# EAGLE schematic RASP_GPIO_DAC_ADC_2 (EAGLE 7.5.0)

## Sheet 1 of 2
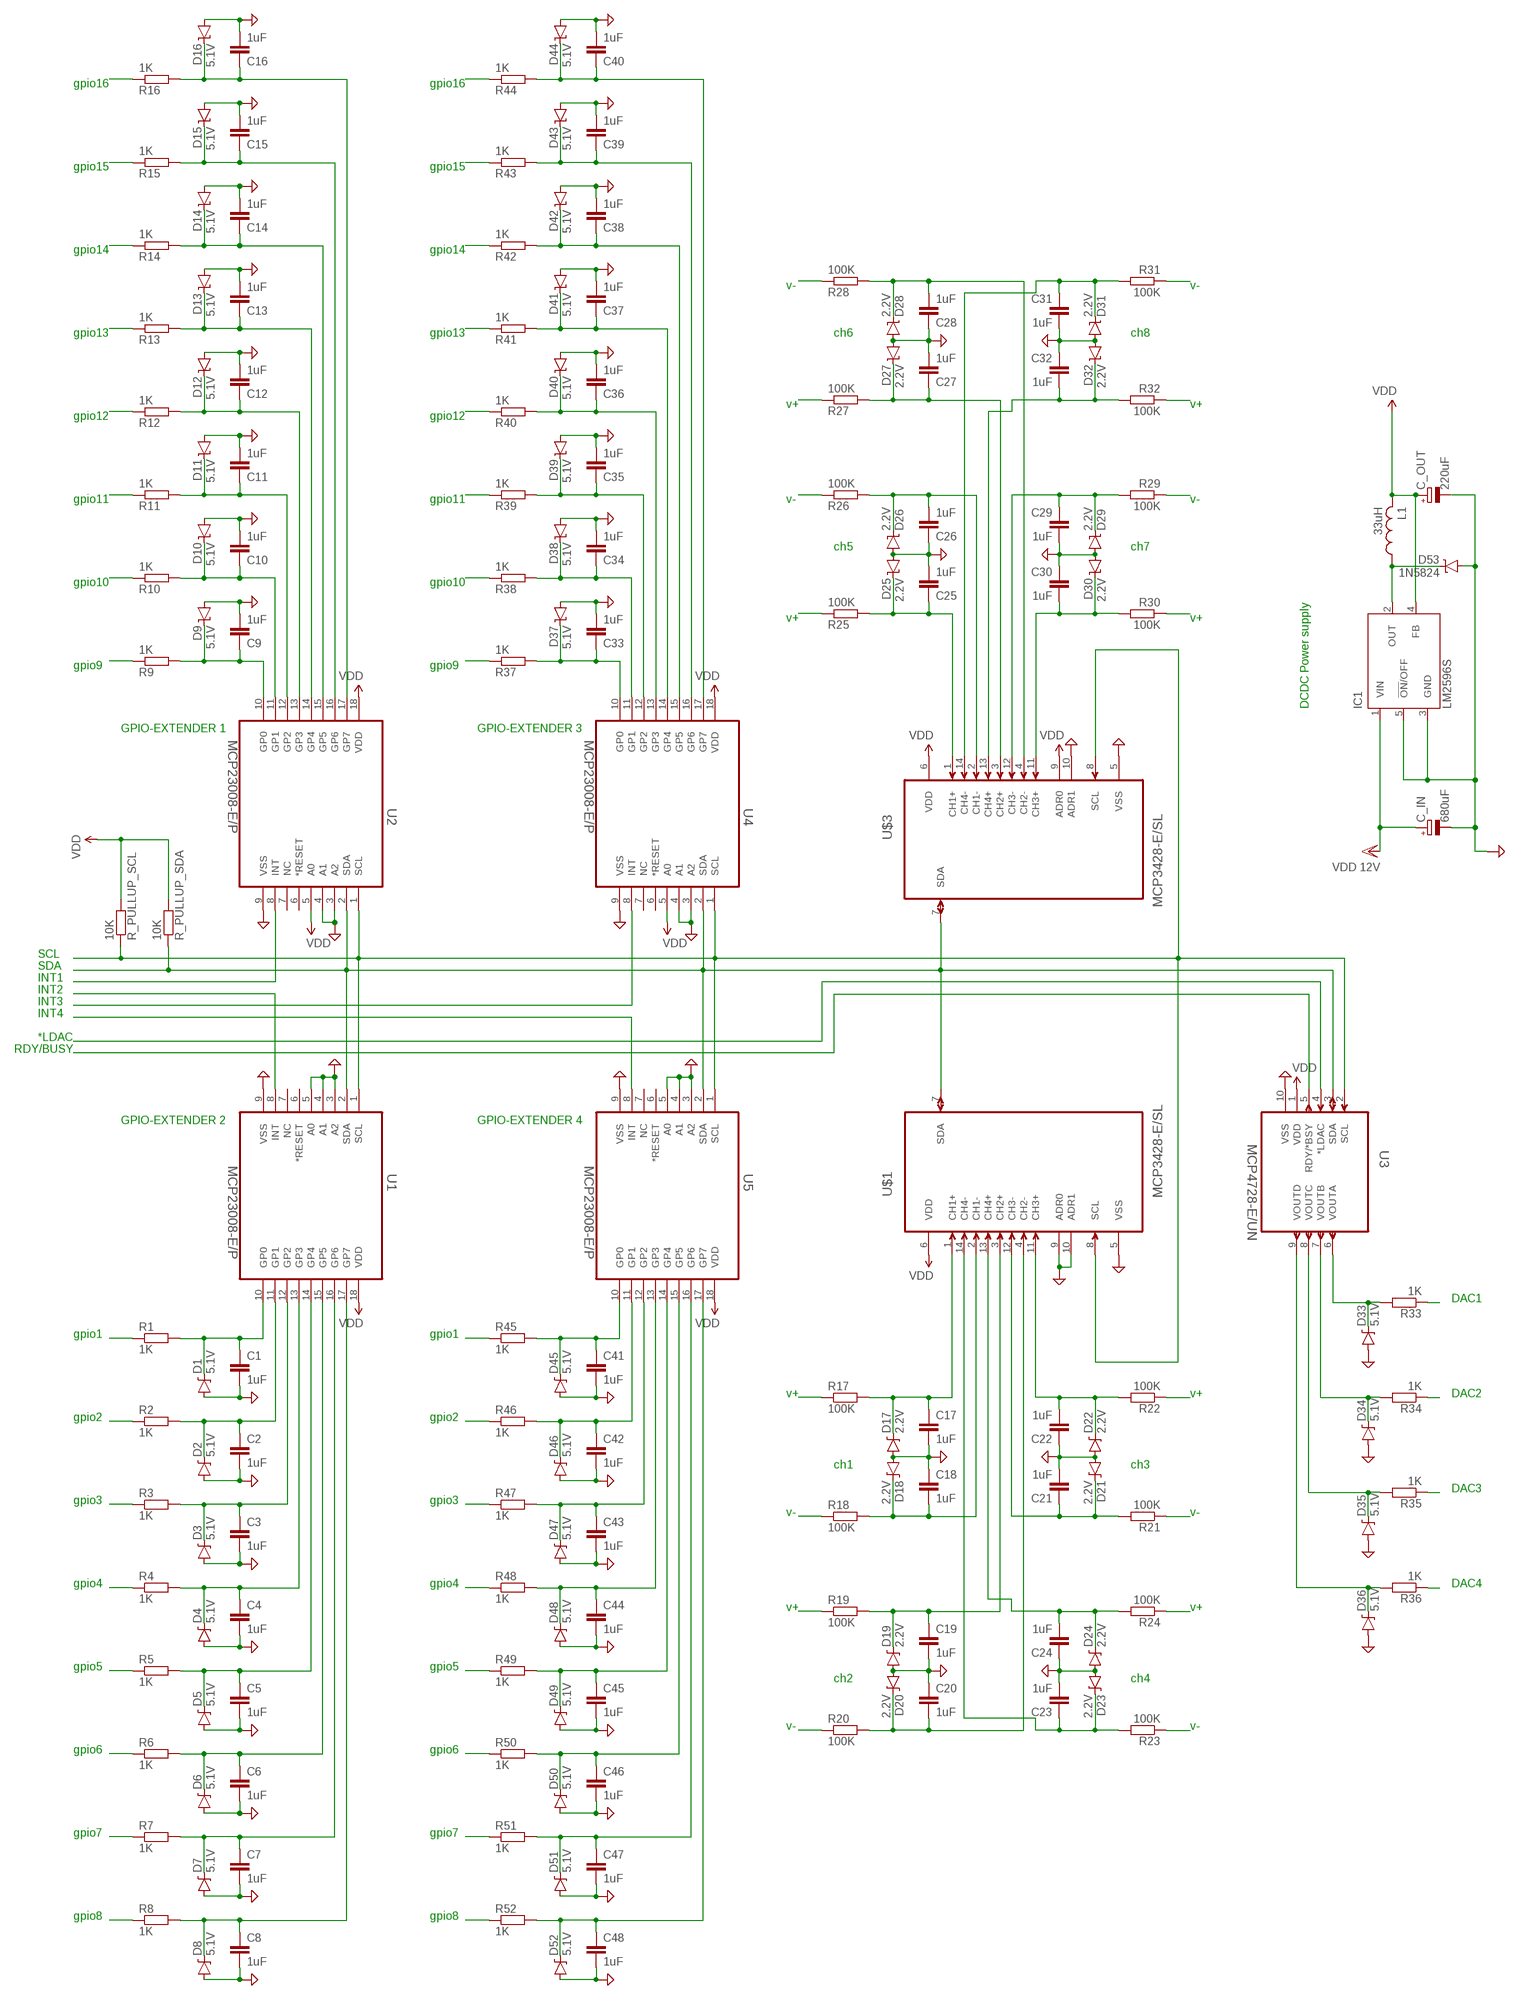
[diagram p0: schematic, sheet 1]

### Parts
C1  1uF  C2,5-3  [C2.5-3]
C2  1uF  C2,5-3  [C2.5-3]
C3  1uF  C2,5-3  [C2.5-3]
C4  1uF  C2,5-3  [C2.5-3]
C5  1uF  C2,5-3  [C2.5-3]
C6  1uF  C2,5-3  [C2.5-3]
C7  1uF  C2,5-3  [C2.5-3]
C8  1uF  C2,5-3  [C2.5-3]
C9  1uF  C2,5-3  [C2.5-3]
C10  1uF  C2,5-3  [C2.5-3]
C11  1uF  C2,5-3  [C2.5-3]
C12  1uF  C2,5-3  [C2.5-3]
C13  1uF  C2,5-3  [C2.5-3]
C14  1uF  C2,5-3  [C2.5-3]
C15  1uF  C2,5-3  [C2.5-3]
C16  1uF  C2,5-3  [C2.5-3]
C17  1uF  C2,5-3  [C2.5-3]
C18  1uF  C2,5-3  [C2.5-3]
C19  1uF  C2,5-3  [C2.5-3]
C20  1uF  C2,5-3  [C2.5-3]
C21  1uF  C2,5-3  [C2.5-3]
C22  1uF  C2,5-3  [C2.5-3]
C23  1uF  C2,5-3  [C2.5-3]
C24  1uF  C2,5-3  [C2.5-3]
C25  1uF  C2,5-3  [C2.5-3]
C26  1uF  C2,5-3  [C2.5-3]
C27  1uF  C2,5-3  [C2.5-3]
C28  1uF  C2,5-3  [C2.5-3]
C29  1uF  C2,5-3  [C2.5-3]
C30  1uF  C2,5-3  [C2.5-3]
C31  1uF  C2,5-3  [C2.5-3]
C32  1uF  C2,5-3  [C2.5-3]
C33  1uF  C2,5-3  [C2.5-3]
C34  1uF  C2,5-3  [C2.5-3]
C35  1uF  C2,5-3  [C2.5-3]
C36  1uF  C2,5-3  [C2.5-3]
C37  1uF  C2,5-3  [C2.5-3]
C38  1uF  C2,5-3  [C2.5-3]
C39  1uF  C2,5-3  [C2.5-3]
C40  1uF  C2,5-3  [C2.5-3]
C41  1uF  C2,5-3  [C2.5-3]
C42  1uF  C2,5-3  [C2.5-3]
C43  1uF  C2,5-3  [C2.5-3]
C44  1uF  C2,5-3  [C2.5-3]
C45  1uF  C2,5-3  [C2.5-3]
C46  1uF  C2,5-3  [C2.5-3]
C47  1uF  C2,5-3  [C2.5-3]
C48  1uF  C2,5-3  [C2.5-3]
C_IN  680uF  CPOL-EU085CS-1AR  [085CS_1AR]
C_OUT  220uF  CPOL-EU085CS-1AR  [085CS_1AR]
D1  5.1V  DIODE-ZENER5.6V  [SOD-323]
D2  5.1V  DIODE-ZENER5.6V  [SOD-323]
D3  5.1V  DIODE-ZENER5.6V  [SOD-323]
D4  5.1V  DIODE-ZENER5.6V  [SOD-323]
D5  5.1V  DIODE-ZENER5.6V  [SOD-323]
D6  5.1V  DIODE-ZENER5.6V  [SOD-323]
D7  5.1V  DIODE-ZENER5.6V  [SOD-323]
D8  5.1V  DIODE-ZENER5.6V  [SOD-323]
D9  5.1V  DIODE-ZENER5.6V  [SOD-323]
D10  5.1V  DIODE-ZENER5.6V  [SOD-323]
D11  5.1V  DIODE-ZENER5.6V  [SOD-323]
D12  5.1V  DIODE-ZENER5.6V  [SOD-323]
D13  5.1V  DIODE-ZENER5.6V  [SOD-323]
D14  5.1V  DIODE-ZENER5.6V  [SOD-323]
D15  5.1V  DIODE-ZENER5.6V  [SOD-323]
D16  5.1V  DIODE-ZENER5.6V  [SOD-323]
D17  2.2V  DIODE-ZENER5.6V  [SOD-323]
D18  2.2V  DIODE-ZENER5.6V  [SOD-323]
D19  2.2V  DIODE-ZENER5.6V  [SOD-323]
D20  2.2V  DIODE-ZENER5.6V  [SOD-323]
D21  2.2V  DIODE-ZENER5.6V  [SOD-323]
D22  2.2V  DIODE-ZENER5.6V  [SOD-323]
D23  2.2V  DIODE-ZENER5.6V  [SOD-323]
D24  2.2V  DIODE-ZENER5.6V  [SOD-323]
D25  2.2V  DIODE-ZENER5.6V  [SOD-323]
D26  2.2V  DIODE-ZENER5.6V  [SOD-323]
D27  2.2V  DIODE-ZENER5.6V  [SOD-323]
D28  2.2V  DIODE-ZENER5.6V  [SOD-323]
D29  2.2V  DIODE-ZENER5.6V  [SOD-323]
D30  2.2V  DIODE-ZENER5.6V  [SOD-323]
D31  2.2V  DIODE-ZENER5.6V  [SOD-323]
D32  2.2V  DIODE-ZENER5.6V  [SOD-323]
D33  5.1V  DIODE-ZENER5.6V  [SOD-323]
D34  5.1V  DIODE-ZENER5.6V  [SOD-323]
D35  5.1V  DIODE-ZENER5.6V  [SOD-323]
D36  5.1V  DIODE-ZENER5.6V  [SOD-323]
D37  5.1V  DIODE-ZENER5.6V  [SOD-323]
D38  5.1V  DIODE-ZENER5.6V  [SOD-323]
D39  5.1V  DIODE-ZENER5.6V  [SOD-323]
D40  5.1V  DIODE-ZENER5.6V  [SOD-323]
D41  5.1V  DIODE-ZENER5.6V  [SOD-323]
D42  5.1V  DIODE-ZENER5.6V  [SOD-323]
D43  5.1V  DIODE-ZENER5.6V  [SOD-323]
D44  5.1V  DIODE-ZENER5.6V  [SOD-323]
D45  5.1V  DIODE-ZENER5.6V  [SOD-323]
D46  5.1V  DIODE-ZENER5.6V  [SOD-323]
D47  5.1V  DIODE-ZENER5.6V  [SOD-323]
D48  5.1V  DIODE-ZENER5.6V  [SOD-323]
D49  5.1V  DIODE-ZENER5.6V  [SOD-323]
D50  5.1V  DIODE-ZENER5.6V  [SOD-323]
D51  5.1V  DIODE-ZENER5.6V  [SOD-323]
D52  5.1V  DIODE-ZENER5.6V  [SOD-323]
D53  1N5824  DIODE-ZENER5.6V  [SOD-323]
IC1  LM2596S  [TO263-5]
L1  33uH  L-US0204/5  [0204/5]
R1  1K  R-EU_0204/2V  [0204V]
R2  1K  R-EU_0204/2V  [0204V]
R3  1K  R-EU_0204/2V  [0204V]
R4  1K  R-EU_0204/2V  [0204V]
R5  1K  R-EU_0204/2V  [0204V]
R6  1K  R-EU_0204/2V  [0204V]
R7  1K  R-EU_0204/2V  [0204V]
R8  1K  R-EU_0204/2V  [0204V]
R9  1K  R-EU_0204/2V  [0204V]
R10  1K  R-EU_0204/2V  [0204V]
R11  1K  R-EU_0204/2V  [0204V]
R12  1K  R-EU_0204/2V  [0204V]
R13  1K  R-EU_0204/2V  [0204V]
R14  1K  R-EU_0204/2V  [0204V]
R15  1K  R-EU_0204/2V  [0204V]
R16  1K  R-EU_0204/2V  [0204V]
R17  100K  R-EU_0204/2V  [0204V]
R18  100K  R-EU_0204/2V  [0204V]
R19  100K  R-EU_0204/2V  [0204V]
R20  100K  R-EU_0204/2V  [0204V]
R21  100K  R-EU_0204/2V  [0204V]
R22  100K  R-EU_0204/2V  [0204V]
R23  100K  R-EU_0204/2V  [0204V]
R24  100K  R-EU_0204/2V  [0204V]
R25  100K  R-EU_0204/2V  [0204V]
R26  100K  R-EU_0204/2V  [0204V]
R27  100K  R-EU_0204/2V  [0204V]
R28  100K  R-EU_0204/2V  [0204V]
R29  100K  R-EU_0204/2V  [0204V]
R30  100K  R-EU_0204/2V  [0204V]
R31  100K  R-EU_0204/2V  [0204V]
R32  100K  R-EU_0204/2V  [0204V]
R33  1K  R-EU_0204/2V  [0204V]
R34  1K  R-EU_0204/2V  [0204V]
R35  1K  R-EU_0204/2V  [0204V]
R36  1K  R-EU_0204/2V  [0204V]
R37  1K  R-EU_0204/2V  [0204V]
R38  1K  R-EU_0204/2V  [0204V]
R39  1K  R-EU_0204/2V  [0204V]
R40  1K  R-EU_0204/2V  [0204V]
R41  1K  R-EU_0204/2V  [0204V]
R42  1K  R-EU_0204/2V  [0204V]
R43  1K  R-EU_0204/2V  [0204V]
R44  1K  R-EU_0204/2V  [0204V]
R45  1K  R-EU_0204/2V  [0204V]
R46  1K  R-EU_0204/2V  [0204V]
R47  1K  R-EU_0204/2V  [0204V]
R48  1K  R-EU_0204/2V  [0204V]
R49  1K  R-EU_0204/2V  [0204V]
R50  1K  R-EU_0204/2V  [0204V]
R51  1K  R-EU_0204/2V  [0204V]
R52  1K  R-EU_0204/2V  [0204V]
R_PULLUP_SCL  10K  R-EU_0204/2V  [0204V]
R_PULLUP_SDA  10K  R-EU_0204/2V  [0204V]
U1  MCP23008-E/P  [DIP254P762X533-18]
U2  MCP23008-E/P  [DIP254P762X533-18]
U3  MCP4728-E/UN  [SOP50P490X110-10N]
U4  MCP23008-E/P  [DIP254P762X533-18]
U5  MCP23008-E/P  [DIP254P762X533-18]
U$1  MCP3428-E/SL  [SOIC127P600X175-14N]
U$3  MCP3428-E/SL  [SOIC127P600X175-14N]

### Nets
GND: C1.2 C2.2 C3.2 C4.2 C5.2 C6.2 C7.2 C8.2 C9.2 C10.2 C11.2 C12.2 C13.2 C14.2 C15.2 C16.2 C17.2 C18.1 C19.2 C20.1 C21.2 C22.1 C23.2 C24.1 C25.2 C26.1 C27.2 C28.1 C29.2 C30.1 C31.2 C32.1 C33.2 C34.2 C35.2 C36.2 C37.2 C38.2 C39.2 C40.2 C41.2 C42.2 C43.2 C44.2 C45.2 C46.2 C47.2 C48.2 C_IN.- C_OUT.- D1.A D2.A D3.A D4.A D5.A D6.A D7.A D8.A D9.A D10.A D11.A D12.A D13.A D14.A D15.A D16.A D17.A D18.A D19.A D20.A D21.A D22.A D23.A D24.A D25.A D26.A D27.A D28.A D29.A D30.A D31.A D32.A D33.A D34.A D35.A D36.A D37.A D38.A D39.A D40.A D41.A D42.A D43.A D44.A D45.A D46.A D47.A D48.A D49.A D50.A D51.A D52.A D53.A IC1.3(GND) IC1.5(!ON!/OFF) U1.3(A2) U1.4(A1) U1.5(A0) U1.9(VSS) U2.3(A2) U2.4(A1) U2.9(VSS) U3.10(VSS) U4.3(A2) U4.4(A1) U4.9(VSS) U5.3(A2) U5.4(A1) U5.5(A0) U5.9(VSS) U$1.5(VSS) U$1.9(ADR0) U$1.10(ADR1) U$3.5(VSS) U$3.10(ADR1) ; also sheet 2
N$2: U1.8(INT)
N$3: R_PULLUP_SDA.1 U1.2(SDA) U2.2(SDA) U3.3(SDA) U4.2(SDA) U5.2(SDA) U$1.7(SDA) U$3.7(SDA)
N$4: U2.8(INT)
N$5: C1.1 D1.C R1.2 U1.10(GP0)
N$6: C2.1 D2.C R2.2 U1.11(GP1)
N$7: R1.1
N$8: R2.1
N$9: C3.1 D3.C R3.2 U1.12(GP2)
N$10: R3.1
N$11: C4.1 D4.C R4.2 U1.13(GP3)
N$12: R4.1
N$13: C5.1 D5.C R5.2 U1.14(GP4)
N$14: R5.1
N$15: C6.1 D6.C R6.2 U1.15(GP5)
N$16: R6.1
N$17: C7.1 D7.C R7.2 U1.16(GP6)
N$18: R7.1
N$19: C8.1 D8.C R8.2 U1.17(GP7)
N$20: R8.1
N$21: C9.1 D9.C R9.2 U2.10(GP0)
N$22: R9.1
N$23: C10.1 D10.C R10.2 U2.11(GP1)
N$24: R10.1
N$25: C11.1 D11.C R11.2 U2.12(GP2)
N$26: R11.1
N$27: C12.1 D12.C R12.2 U2.13(GP3)
N$28: R12.1
N$29: C13.1 D13.C R13.2 U2.14(GP4)
N$30: R13.1
N$31: C14.1 D14.C R14.2 U2.15(GP5)
N$32: R14.1
N$33: C15.1 D15.C R15.2 U2.16(GP6)
N$34: R15.1
N$35: C16.1 D16.C R16.2 U2.17(GP7)
N$36: R16.1
N$37: C17.1 D17.C R17.2 U$1.1(CH1+)
N$38: R17.1
N$39: C18.2 D18.C R18.2 U$1.2(CH1-)
N$40: C21.1 D21.C R21.2 U$1.12(CH3-)
N$41: R18.1
N$42: C19.1 D19.C R19.2 U$1.3(CH2+)
N$43: R19.1
N$44: C20.2 D20.C R20.2 U$1.4(CH2-)
N$45: R20.1
N$46: R21.1
N$47: C22.2 D22.C R22.2 U$1.11(CH3+)
N$48: R22.1
N$49: C23.1 D23.C R23.2 U$1.14(CH4-)
N$50: R23.1
N$51: C24.2 D24.C R24.2 U$1.13(CH4+)
N$52: R24.1
N$53: C25.1 D25.C R25.2 U$3.1(CH1+)
N$54: R25.1
N$55: C26.2 D26.C R26.2 U$3.2(CH1-)
N$56: R26.1
N$57: C27.1 D27.C R27.2 U$3.3(CH2+)
N$58: R27.1
N$59: C28.2 D28.C R28.2 U$3.4(CH2-)
N$60: R28.1
N$61: C29.1 D29.C R29.2 U$3.12(CH3-)
N$62: R29.1
N$63: C30.2 D30.C R30.2 U$3.11(CH3+)
N$64: R30.1
N$65: C31.1 D31.C R31.2 U$3.14(CH4-)
N$66: R31.1
N$67: C32.2 D32.C R32.2 U$3.13(CH4+)
N$68: R32.1
N$69: D33.C R33.2 U3.6(VOUTA)
N$70: R33.1
N$71: D34.C R34.2 U3.7(VOUTB)
N$72: R34.1
N$73: D35.C R35.2 U3.8(VOUTC)
N$74: R35.1
N$75: D36.C R36.2 U3.9(VOUTD)
N$76: R36.1
N$77: U3.4(*LDAC)
N$78: U4.8(INT)
N$79: U3.5(RDY/*BSY)
N$80: C33.1 D37.C R37.2 U4.10(GP0)
N$81: R37.1
N$82: C34.1 D38.C R38.2 U4.11(GP1)
N$83: R38.1
N$84: C35.1 D39.C R39.2 U4.12(GP2)
N$85: R39.1
N$86: C36.1 D40.C R40.2 U4.13(GP3)
N$87: R40.1
N$88: C37.1 D41.C R41.2 U4.14(GP4)
N$89: R41.1
N$90: C38.1 D42.C R42.2 U4.15(GP5)
N$91: R42.1
N$92: C39.1 D43.C R43.2 U4.16(GP6)
N$93: R43.1
N$94: C40.1 D44.C R44.2 U4.17(GP7)
N$95: R44.1
N$96: D53.C IC1.2(OUT) L1.1
N$97: U5.8(INT)
N$98: R_PULLUP_SCL.1 U1.1(SCL) U2.1(SCL) U3.2(SCL) U4.1(SCL) U5.1(SCL) U$1.8(SCL) U$3.8(SCL)
N$99: C41.1 D45.C R45.2 U5.10(GP0)
N$100: R45.1
N$101: C42.1 D46.C R46.2 U5.11(GP1)
N$102: R46.1
N$103: C43.1 D47.C R47.2 U5.12(GP2)
N$104: R47.1
N$105: C44.1 D48.C R48.2 U5.13(GP3)
N$106: R48.1
N$107: C45.1 D49.C R49.2 U5.14(GP4)
N$108: R49.1
N$109: C46.1 D50.C R50.2 U5.15(GP5)
N$110: R50.1
N$111: C47.1 D51.C R51.2 U5.16(GP6)
N$112: R51.1
N$113: C48.1 D52.C R52.2 U5.17(GP7)
N$114: R52.1
VDD: C_IN.+ C_OUT.+ IC1.1(VIN) IC1.4(FB) L1.2 R_PULLUP_SCL.2 R_PULLUP_SDA.2 U1.18(VDD) U2.5(A0) U2.18(VDD) U3.1(VDD) U4.5(A0) U4.18(VDD) U5.18(VDD) U$1.6(VDD) U$3.6(VDD) U$3.9(ADR0) ; supply symbol labelled VDD 12V ; also sheet 2
Unconnected: U1.6(*RESET) U1.7(NC) U2.6(*RESET) U2.7(NC) U4.6(*RESET) U4.7(NC) U5.6(*RESET) U5.7(NC)

### Notes on the sheet
- gpio16 | gpio16
- gpio15 | gpio15
- gpio14 | gpio14
- v- | v-
- gpio13 | gpio13 | ch6 | ch8
- v+ | v+
- gpio12 | gpio12
- gpio11 | gpio11 | v- | v-
- ch5 | ch7
- gpio10 | gpio10
- v+ | v+
- gpio9 | gpio9
- DCDC Power supply
- GPIO-EXTENDER 1 | GPIO-EXTENDER 3
- SCL
- SDA
- INT1
- INT2
- INT3
- INT4
- *LDAC
- RDY/BUSY
- GPIO-EXTENDER 2 | GPIO-EXTENDER 4
- DAC1
- gpio1 | gpio1
- v+ | v+ | DAC2
- gpio2 | gpio2
- ch1 | ch3
- DAC3
- gpio3 | gpio3
- v- | v-
- gpio4 | gpio4 | DAC4
- v+ | v+
- gpio5 | gpio5
- ch2 | ch4
- v- | v-
- gpio6 | gpio6
- gpio7 | gpio7
- gpio8 | gpio8

## Sheet 2 of 2
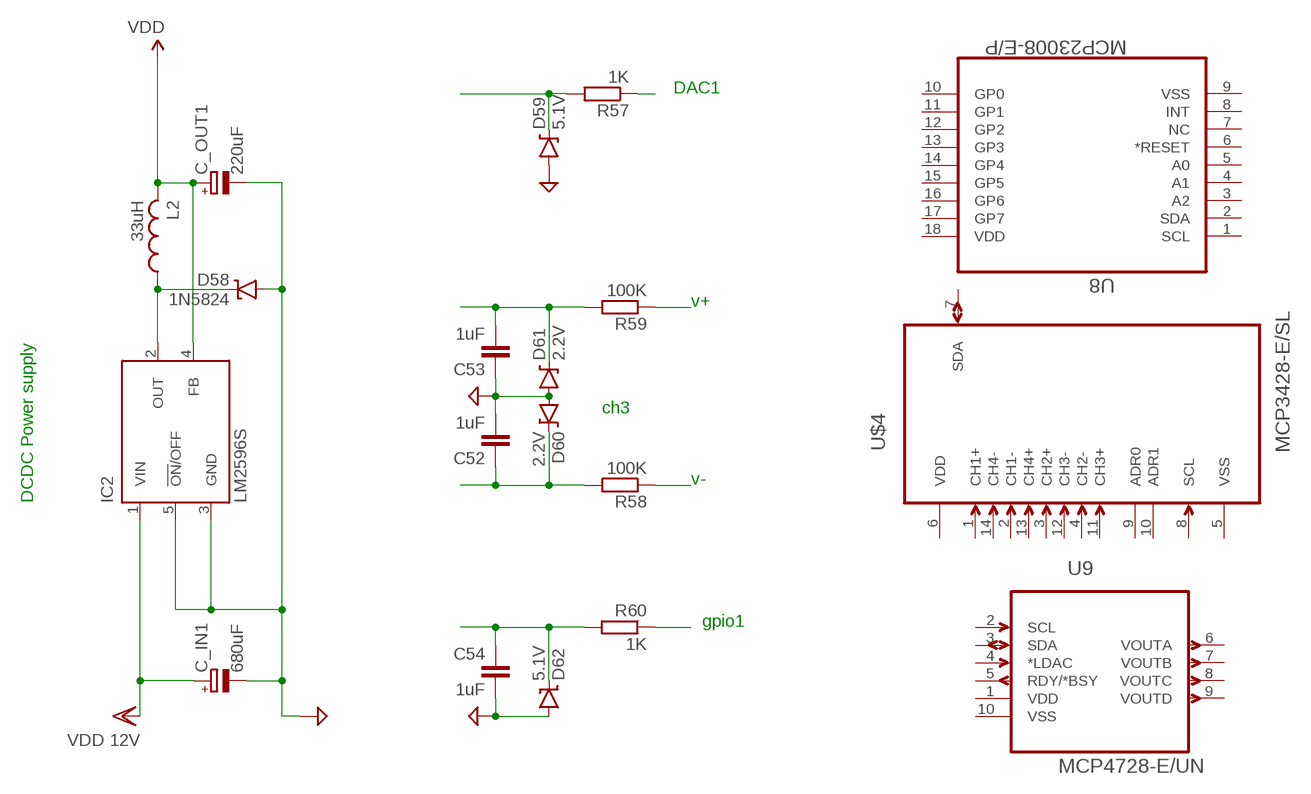
[diagram p1: schematic, sheet 2]

### Parts
C52  1uF  C2,5-3  [C2.5-3]
C53  1uF  C2,5-3  [C2.5-3]
C54  1uF  C2,5-3  [C2.5-3]
C_IN1  680uF  CPOL-EU085CS-1AR  [085CS_1AR]
C_OUT1  220uF  CPOL-EU085CS-1AR  [085CS_1AR]
D58  1N5824  DIODE-ZENER5.6V  [SOD-323]
D59  5.1V  DIODE-ZENER5.6V  [SOD-323]
D60  2.2V  DIODE-ZENER5.6V  [SOD-323]
D61  2.2V  DIODE-ZENER5.6V  [SOD-323]
D62  5.1V  DIODE-ZENER5.6V  [SOD-323]
IC2  LM2596S  [TO263-5]
L2  33uH  L-US0204/5  [0204/5]
R57  1K  R-EU_0204/2V  [0204V]
R58  100K  R-EU_0204/2V  [0204V]
R59  100K  R-EU_0204/2V  [0204V]
R60  1K  R-EU_0204/2V  [0204V]
U8  MCP23008-E/P  [DIP254P762X533-18]
U9  MCP4728-E/UN  [SOP50P490X110-10N]
U$4  MCP3428-E/SL  [SOIC127P600X175-14N]

### Nets
GND: C52.2 C53.1 C54.2 C_IN1.- C_OUT1.- D58.A D59.A D60.A D61.A D62.A IC2.3(GND) IC2.5(!ON!/OFF) ; also sheet 1
N$122: D58.C IC2.2(OUT) L2.1
N$123: D59.C R57.2
N$124: R57.1
N$125: C52.1 D60.C R58.2
N$126: R58.1
N$127: C53.2 D61.C R59.2
N$128: R59.1
N$129: C54.1 D62.C R60.2
N$130: R60.1
VDD: C_IN1.+ C_OUT1.+ IC2.1(VIN) IC2.4(FB) L2.2 ; supply symbol labelled VDD 12V ; also sheet 1
Unconnected: U8.1(SCL) U8.2(SDA) U8.3(A2) U8.4(A1) U8.5(A0) U8.6(*RESET) U8.7(NC) U8.8(INT) U8.9(VSS) U8.10(GP0) U8.11(GP1) U8.12(GP2) U8.13(GP3) U8.14(GP4) U8.15(GP5) U8.16(GP6) U8.17(GP7) U9.2(SCL) U9.3(SDA) U9.4(*LDAC) U9.5(RDY/*BSY) U9.6(VOUTA) U9.7(VOUTB) U9.8(VOUTC) U9.9(VOUTD) U$4.1(CH1+) U$4.2(CH1-) U$4.3(CH2+) U$4.4(CH2-) U$4.7(SDA) U$4.8(SCL) U$4.9(ADR0) U$4.10(ADR1) U$4.11(CH3+) U$4.12(CH3-) U$4.13(CH4+) U$4.14(CH4-)

### Notes on the sheet
- DAC1
- v+
- ch3
- v-
- DCDC Power supply
- gpio1

## Power pins joined to a net without a drawn wire
VDD: U8.18(VDD) U9.1(VDD) U$4.6(VDD)
VSS: U9.10(VSS) U$4.5(VSS)

## Library data of the parts
C1-C48 C52-C54 = capacitor-wima:C: CAPACITOR naming: grid - package width
C_IN C_IN1 C_OUT C_OUT1 = rcl:CPOL-EU: POLARIZED CAPACITOR, European symbol
D1-D53 D58-D62 = SparkFun-DiscreteSemi:DIODE-ZENER: Zener Diode Production Part - 8199 3.4V Zener Voltage; PROD_ID: DIO-12442; VALUE: 5.6V
IC1 IC2 = national-semiconductor:LM2596: SIMPLE SWITCHER® Power Converter 150 kHz 3A Step-Down Voltage Regulator Source: http://www.national.com/ds/LM/LM2596.pdf; MF: NATIONAL SEMICONDUCTOR; MPN: LM2596S-ADJ/NOPB; OC_FARNELL: 9494367; OC_NEWARK: 41K3842
L1 L2 = rcl:L-US: INDUCTOR, American symbol
R1-R52 R57-R60 R_PULLUP_SCL R_PULLUP_SDA = resistor:R-EU_: RESISTOR, European symbol
U1 U2 U4 U5 U8 = Microchip_By_element14_Batch_1:MCP23008-E/P: IC I/O EXPANDER I2C 8B; MPN: MCP23008-E/P; OC_FARNELL: 1439387; OC_NEWARK: 08J8737; PACKAGE: 18DIP; SUPPLIER: Microchip
U3 U9 = Microchip_By_element14_Batch_1:MCP4728-E/UN: IC, DAC, 12BIT, QUAD; MPN: MCP4728-E/UN; OC_FARNELL: 1800217; OC_NEWARK: 08R1808; PACKAGE: MSOP-10; SUPPLIER: MICROCHIP
U$1 U$3 U$4 = Microchip_By_element14_Batch_1:MCP3428-E/SL: Analog-to-Digital Converter; MPN: MCP3428-E/SL; OC_FARNELL: 1825014; OC_NEWARK: 52R9962; PACKAGE: SOIC-14; SUPPLIER: Microchip